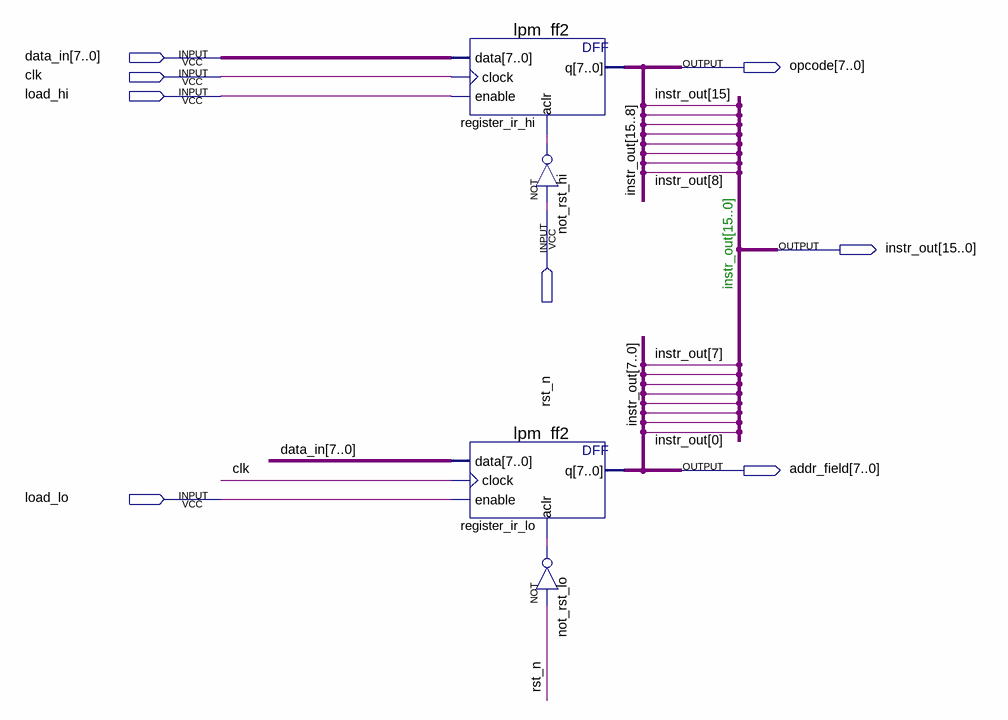
[diagram p0: schematic sheet]
// Quartus schematic ir_unit.bdf as structural Verilog: 4 symbols, 8 pins
module ir_unit (
  input  [7:0] data_in,
  input  clk,
  input  load_hi,
  input  rst_n,
  input  load_lo,
  output [7:0] opcode,
  output [15:0] instr_out,
  output [7:0] addr_field
);

  wire not_rst_hi_out, not_rst_lo_out;

  lpm_ff2 register_ir_hi (.data(data_in), .clock(clk), .enable(load_hi), .aclr(not_rst_hi_out), .q(instr_out[15:8]));
  lpm_ff2 register_ir_lo (.data(data_in), .clock(clk), .enable(load_lo), .aclr(not_rst_lo_out), .q(addr_field));
  not not_rst_hi (not_rst_hi_out, rst_n);
  not not_rst_lo (not_rst_lo_out, rst_n);

  assign instr_out[7:0] = addr_field;
  assign opcode = instr_out[15:8];
endmodule
